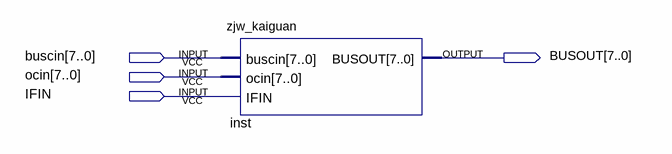
[diagram p0: schematic sheet]
// Quartus schematic Block1.bdf as structural Verilog: 1 symbols, 4 pins
module Block1 (
  input  [7:0] buscin,
  input  [7:0] ocin,
  input  IFIN,
  output [7:0] BUSOUT
);

  zjw_kaiguan inst (.buscin(buscin), .ocin(ocin), .IFIN(IFIN), .BUSOUT(BUSOUT));
endmodule
